# Altium schematic sheet preamp - copia.SchDoc
size A4
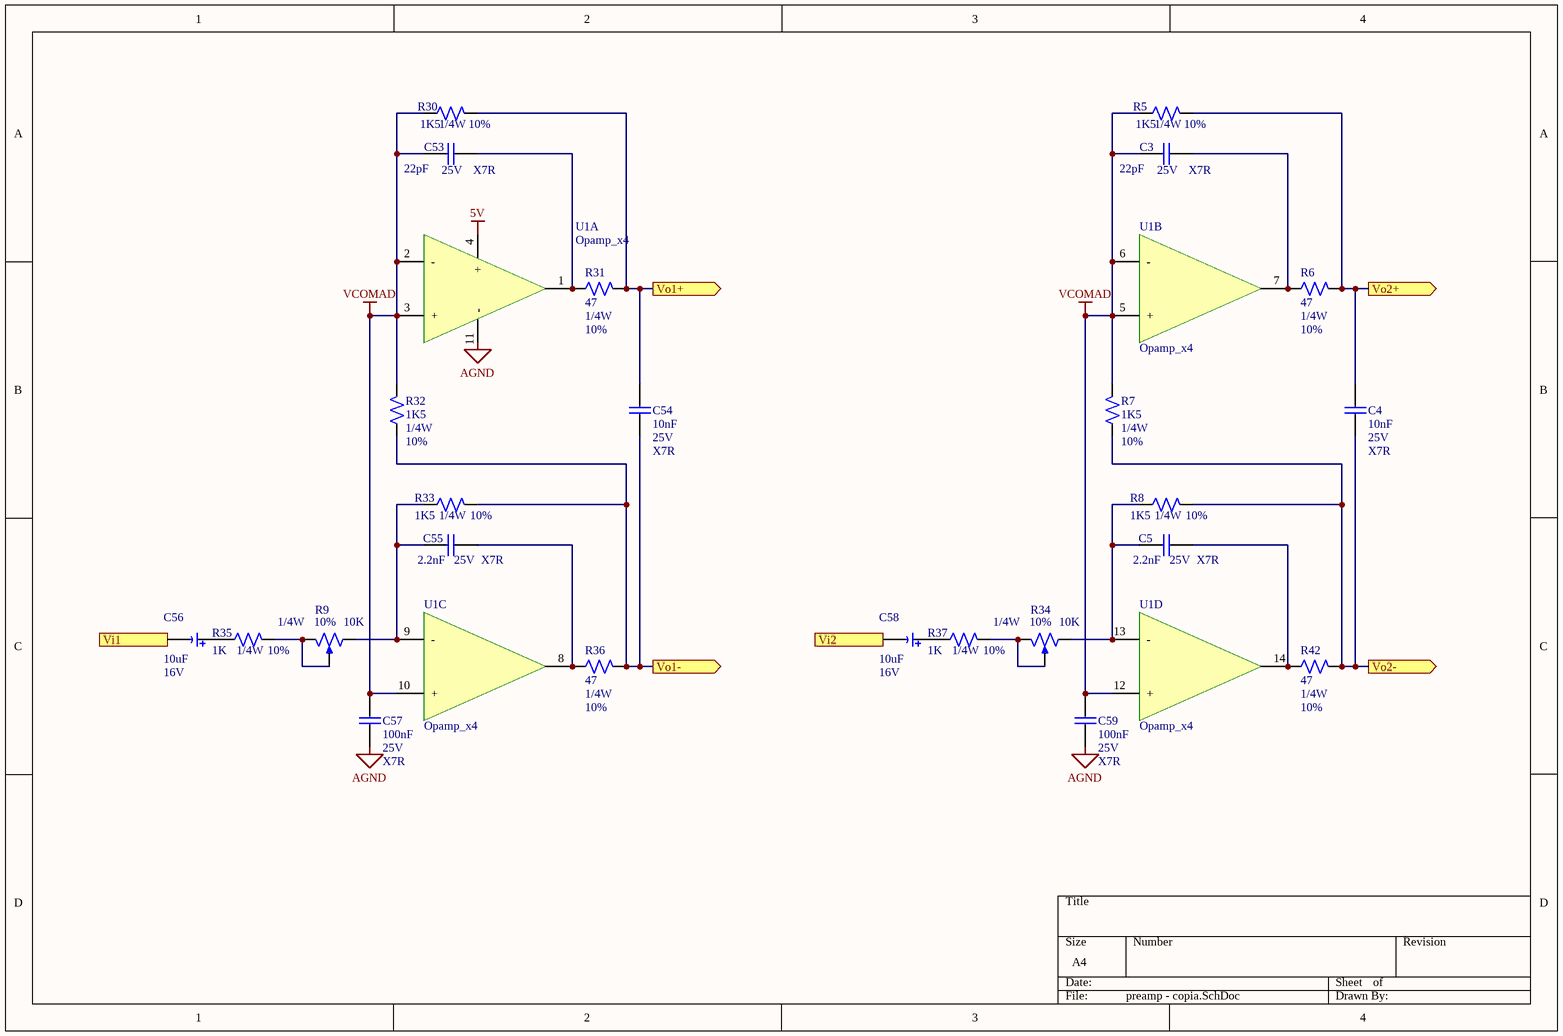
[diagram p0: preamp - copia.SchDoc]

## Parts
C3  valor: 22pF  tension: 25V  tolerancia: X7R  [C0805]  (hidden comment: Capacitor)
C4  valor: 10nF  tension: 25V  tolerancia: X7R  [C0805]  (hidden comment: Capacitor)
C5  valor: 2.2nF  tension: 25V  tolerancia: X7R  [C0805]  (hidden comment: Capacitor)
C53  valor: 22pF  tension: 25V  tolerancia: X7R  [C0805]  (hidden comment: Capacitor)
C54  valor: 10nF  tension: 25V  tolerancia: X7R  [C0805]  (hidden comment: Capacitor)
C55  valor: 2.2nF  tension: 25V  tolerancia: X7R  [C0805]  (hidden comment: Capacitor)
C56  valor: 10uF  tension: 16V  [AVX_C]  (hidden comment: Capacitor polarizado)
C57  valor: 100nF  tension: 25V  tolerancia: X7R  [C0805]  (hidden comment: Capacitor)
C58  valor: 10uF  tension: 16V  [AVX_C]  (hidden comment: Capacitor polarizado)
C59  valor: 100nF  tension: 25V  tolerancia: X7R  [C0805]  (hidden comment: Capacitor)
R5  Valor: 1K5  Potencia: 1/4W  Tolerancia: 10%  [R0603]  (hidden comment: Resistor)
R6  Valor: 47  Potencia: 1/4W  Tolerancia: 10%  [R0603]  (hidden comment: Resistor)
R7  Valor: 1K5  Potencia: 1/4W  Tolerancia: 10%  [R0603]  (hidden comment: Resistor)
R8  Valor: 1K5  Potencia: 1/4W  Tolerancia: 10%  [R0603]  (hidden comment: Resistor)
R9  valor: 10K  Tolerancia: 10%  Potencia: 1/4W  [POTE]  (hidden comment: Potenciometro)
R30  Valor: 1K5  Potencia: 1/4W  Tolerancia: 10%  [R0603]  (hidden comment: Resistor)
R31  Valor: 47  Potencia: 1/4W  Tolerancia: 10%  [R0603]  (hidden comment: Resistor)
R32  Valor: 1K5  Potencia: 1/4W  Tolerancia: 10%  [R0603]  (hidden comment: Resistor)
R33  Valor: 1K5  Potencia: 1/4W  Tolerancia: 10%  [R0603]  (hidden comment: Resistor)
R34  valor: 10K  Tolerancia: 10%  Potencia: 1/4W  [POTE]  (hidden comment: Potenciometro)
R35  Valor: 1K  Potencia: 1/4W  Tolerancia: 10%  [R0603]  (hidden comment: Resistor)
R36  Valor: 47  Potencia: 1/4W  Tolerancia: 10%  [R0603]  (hidden comment: Resistor)
R37  Valor: 1K  Potencia: 1/4W  Tolerancia: 10%  [R0603]  (hidden comment: Resistor)
R42  Valor: 47  Potencia: 1/4W  Tolerancia: 10%  [R0603]  (hidden comment: Resistor)
U1  Opamp_x4  [TSSOP-14]  (parts A,B,C,D of 4)

## Ports
Vi1 (in), Vi2 (in), Vo1+ (out), Vo1- (out), Vo2+ (out), Vo2- (out)

## Nets
5V: U1.4(+)
AGND: C57.2 C59.2 U1.11(-)
VCOMAD: C3.2 C53.2 C57.1 C59.1 R5.1 R7.2 R30.1 R32.2 U1.2(-) U1.3(+) U1.5(+) U1.6(-) U1.10(+) U1.12(+)
Vi1: C56.2 ; port Vi1
Vi2: C58.2 ; port Vi2
Vo1+: C54.1 R30.2 R31.2 ; port Vo1+
Vo1-: C54.2 R32.1 R33.2 R36.2 ; port Vo1-
Vo2+: C4.1 R5.2 R6.2 ; port Vo2+
Vo2-: C4.2 R7.1 R8.2 R42.2 ; port Vo2-
NetC3_1: C3.1 R6.1 U1.7(OUT)
NetC5_1: C5.1 R42.1 U1.14(OUT)
NetC5_2: C5.2 R8.1 R34.2 U1.13(-)
NetC53_1: C53.1 R31.1 U1.1(OUT)
NetC55_1: C55.1 R36.1 U1.8(OUT)
NetC55_2: C55.2 R9.2 R33.1 U1.9(-)
NetC56_1: C56.1 R35.1
NetC58_1: C58.1 R37.1
NetR9_1: R9.1 R9.3 R35.2
NetR34_1: R34.1 R34.3 R37.2

## Library data of the parts
C3-C5 C53-C55 C57 C59 = Capacitor: Capacitor de placas paralelas; Encapsulado: 0805
R5-R8 R30-R33 R35-R37 R42 = Resistor: Resistencia
R9 R34 = Potenciometer
U1 = Opamp_x4: Integrado con 4 operacionales